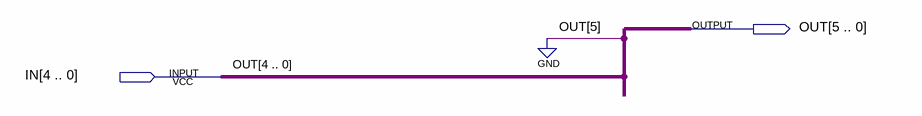
[diagram p0: schematic sheet]
// Quartus schematic 5B_to_6B.bdf as structural Verilog: 0 symbols, 2 pins
module \5B_to_6B  (
  input  [4:0] IN,
  output [5:0] OUT
);


  assign OUT = {1'b0, IN};
endmodule
